# EAGLE schematic sputnik_prototype (EAGLE 7.4.0)
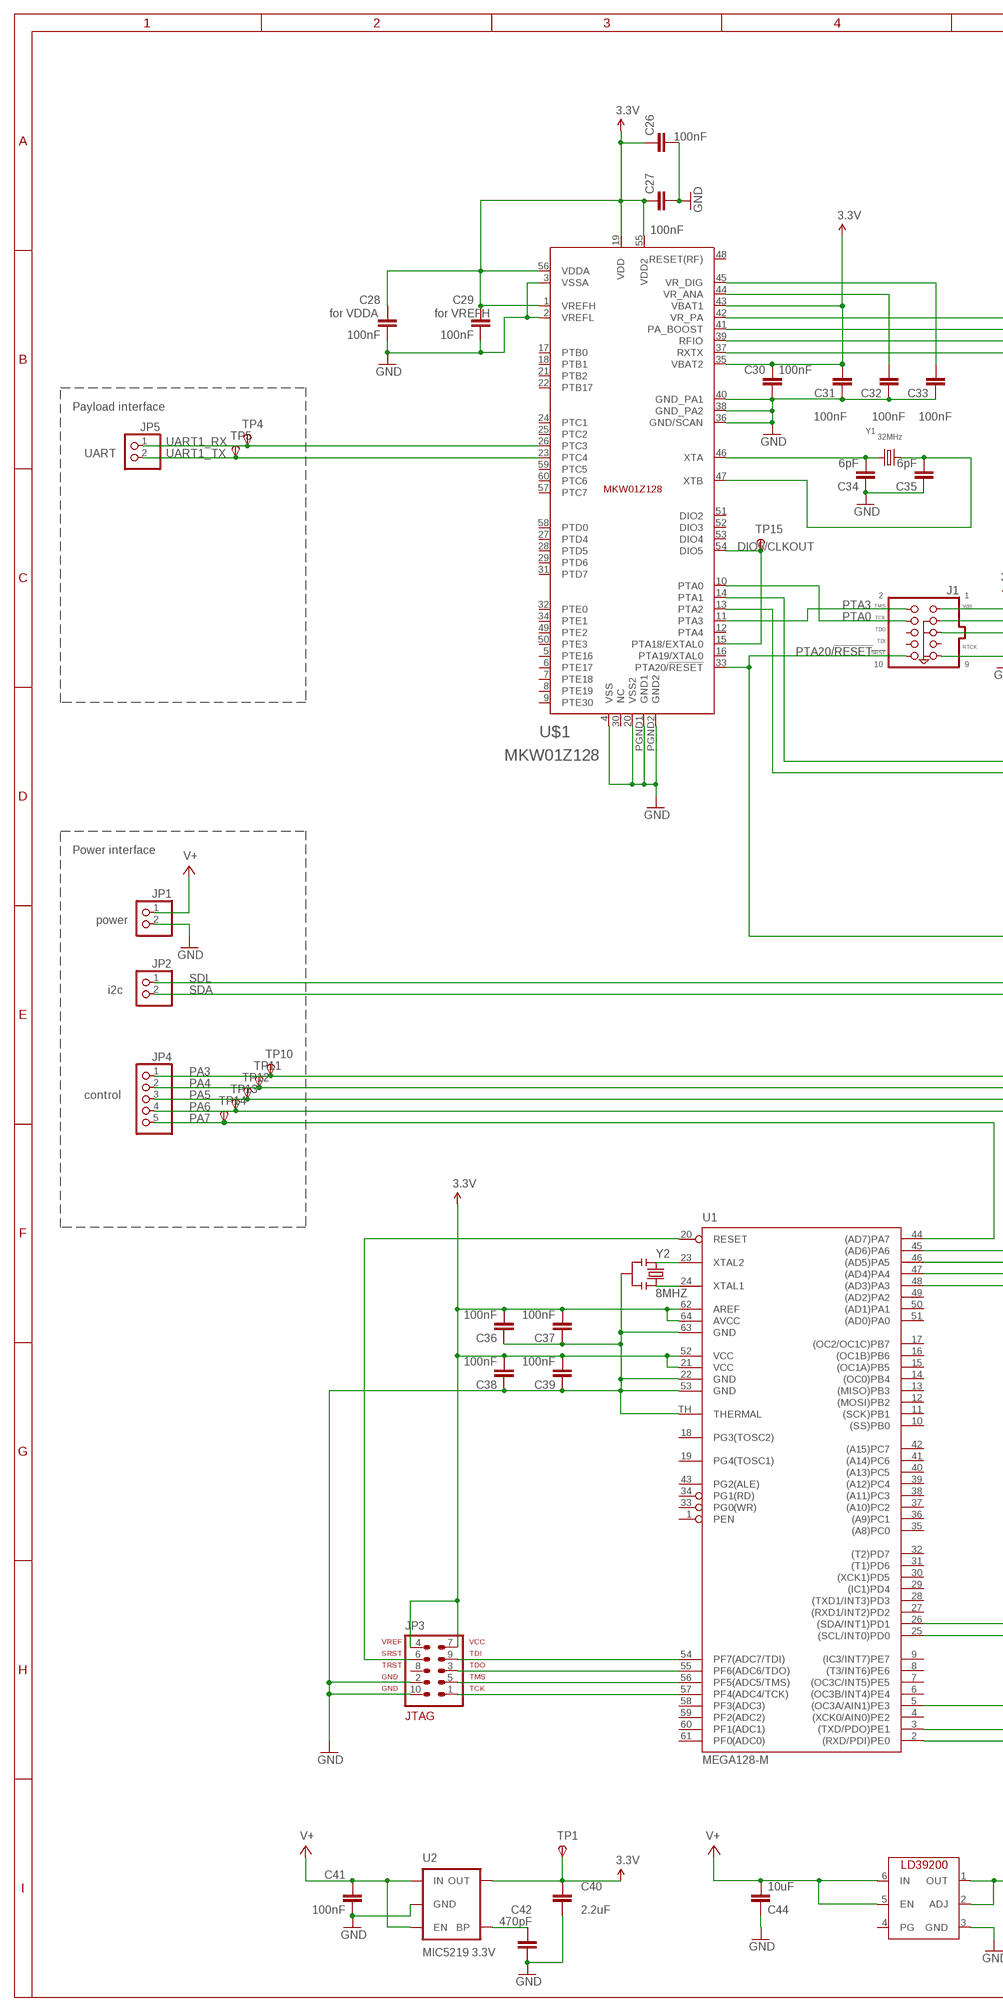
[diagram p0: schematic, sheet 1, part 1 of 2]
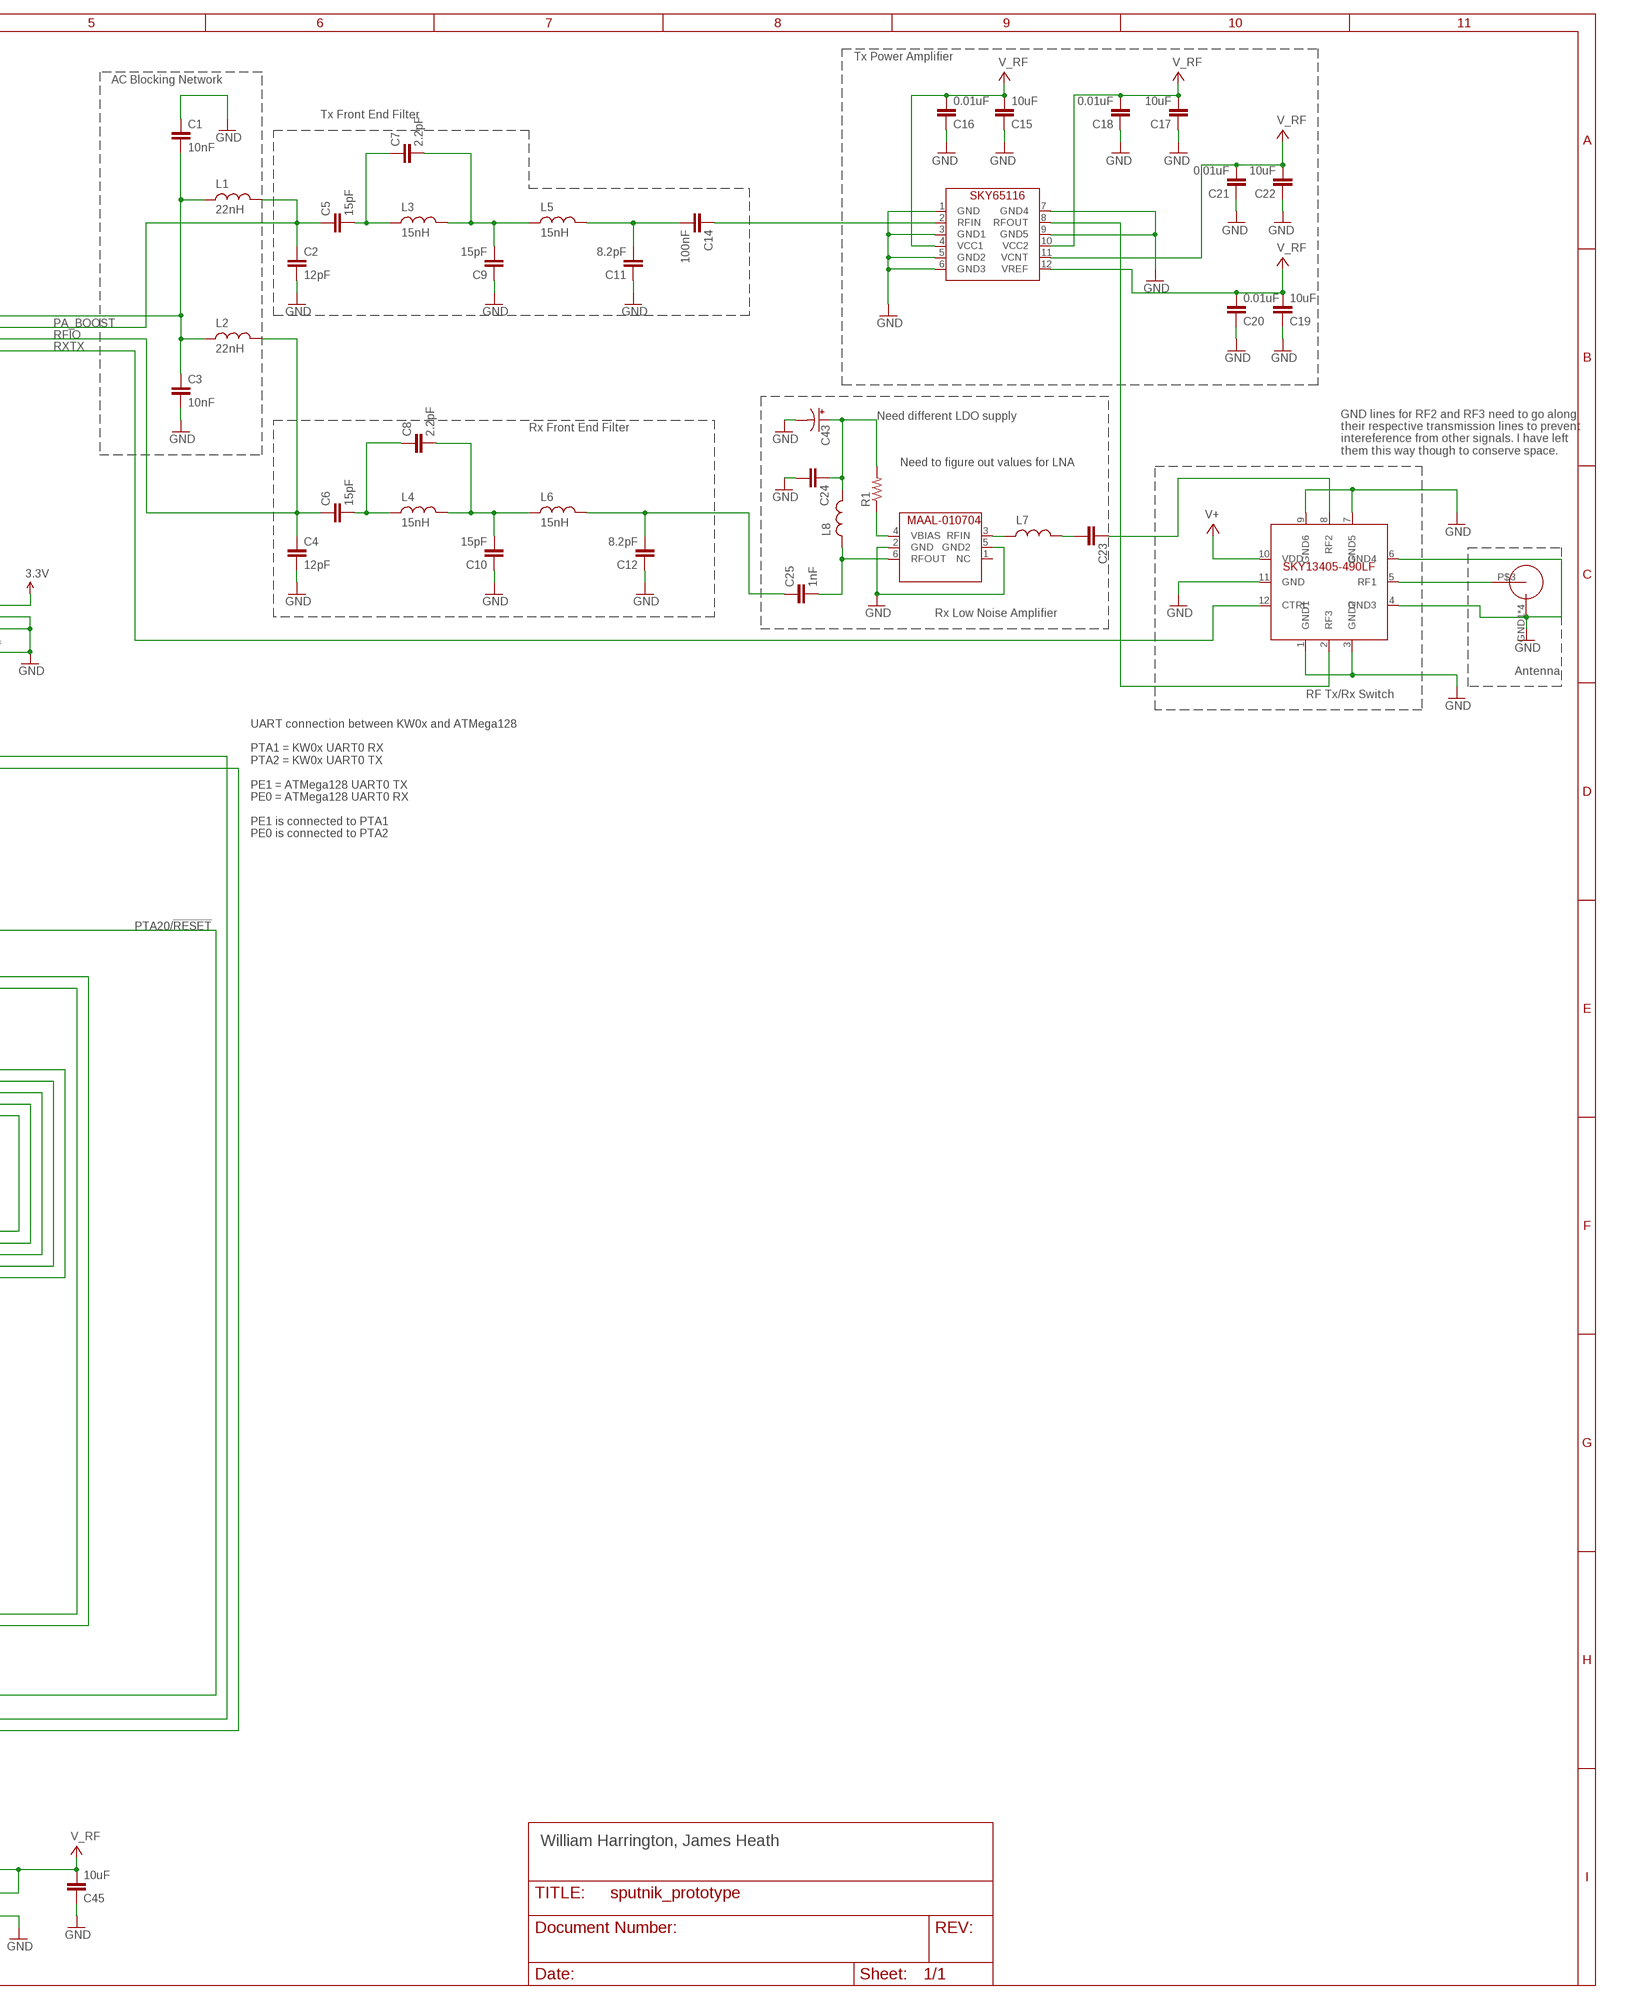
[diagram p1: schematic, sheet 1, part 2 of 2]

## Parts
C1  10nF  C-EU0603-B-NOSILK  [.0603-B-NOSILK]
C2  12pF  C-EU0603-B-NOSILK  [.0603-B-NOSILK]
C3  10nF  C-EU0603-B-NOSILK  [.0603-B-NOSILK]
C4  12pF  C-EU0603-B-NOSILK  [.0603-B-NOSILK]
C5  15pF  C-EU0603-B-NOSILK  [.0603-B-NOSILK]
C6  15pF  C-EU0603-B-NOSILK  [.0603-B-NOSILK]
C7  2.2pF  C-EU0603-B-NOSILK  [.0603-B-NOSILK]
C8  2.2pF  C-EU0603-B-NOSILK  [.0603-B-NOSILK]
C9  15pF  C-EU0603-B-NOSILK  [.0603-B-NOSILK]
C10  15pF  C-EU0603-B-NOSILK  [.0603-B-NOSILK]
C11  8.2pF  C-EU0603-B-NOSILK  [.0603-B-NOSILK]
C12  8.2pF  C-EU0603-B-NOSILK  [.0603-B-NOSILK]
C14  100nF  C-EU0603-B-NOSILK  [.0603-B-NOSILK]
C15  10uF  C-EU0603-B-NOSILK  [.0603-B-NOSILK]
C16  0.01uF  C-EU0603-B-NOSILK  [.0603-B-NOSILK]
C17  10uF  C-EU0603-B-NOSILK  [.0603-B-NOSILK]
C18  0.01uF  C-EU0603-B-NOSILK  [.0603-B-NOSILK]
C19  10uF  C-EU0603-B-NOSILK  [.0603-B-NOSILK]
C20  0.01uF  C-EU0603-B-NOSILK  [.0603-B-NOSILK]
C21  0.01uF  C-EU0603-B-NOSILK  [.0603-B-NOSILK]
C22  10uF  C-EU0603-B-NOSILK  [.0603-B-NOSILK]
C23  C-EU0402-B-NOSILK  [.0402-B-NOSILK]
C24  C-EU0402-B-NOSILK  [.0402-B-NOSILK]
C25  1nF  C-EU0402-B-NOSILK  [.0402-B-NOSILK]
C26  100nF  C-EU0603-B-NOSILK  [.0603-B-NOSILK]
C27  100nF  C-EU0603-B-NOSILK  [.0603-B-NOSILK]
C28  100nF  C-EU0603-B-NOSILK  [.0603-B-NOSILK]
C29  100nF  C-EU0603-B-NOSILK  [.0603-B-NOSILK]
C30  100nF  C-EU0603-B-NOSILK  [.0603-B-NOSILK]
C31  100nF  C-EU0603-B-NOSILK  [.0603-B-NOSILK]
C32  100nF  C-EU0603-B-NOSILK  [.0603-B-NOSILK]
C33  100nF  C-EU0603-B-NOSILK  [.0603-B-NOSILK]
C34  6pF  C-EU0603-B-NOSILK  [.0603-B-NOSILK]
C35  6pF  C-EU0603-B-NOSILK  [.0603-B-NOSILK]
C36  100nF  C-EU0603-B-NOSILK  [.0603-B-NOSILK]
C37  100nF  C-EU0603-B-NOSILK  [.0603-B-NOSILK]
C38  100nF  C-EU0603-B-NOSILK  [.0603-B-NOSILK]
C39  100nF  C-EU0603-B-NOSILK  [.0603-B-NOSILK]
C40  2.2uF  C-EU0603-B-NOSILK  [.0603-B-NOSILK]
C41  100nF  C-EU0603-B-NOSILK  [.0603-B-NOSILK]
C42  470pF  C-EU0603-B-NOSILK  [.0603-B-NOSILK]
C43  CPOL-USCT6032  [CT6032]
C44  10uF  C-EU0603-B-NOSILK  [.0603-B-NOSILK]
C45  10uF  C-EU0603-B-NOSILK  [.0603-B-NOSILK]
J1  JTAG_ARM-10-50MIL  [PINHEADER-2X5-0.05+POL+SILK]
JP1  PINHD-1X2  [1X02]
JP2  PINHD-1X2  [1X02]
JP3  AVR-JTAG-10  [AVR-JTAG-10]
JP4  PINHD-1X55X2MM  [1_05X2MM]
JP5  PINHD-1X2  [1X02]
L1  22nH  L-US0603-B-NOSILK  [.0603-B-NOSILK]
L2  22nH  L-US0603-B-NOSILK  [.0603-B-NOSILK]
L3  15nH  L-US0603-B-NOSILK  [.0603-B-NOSILK]
L4  15nH  L-US0603-B-NOSILK  [.0603-B-NOSILK]
L5  15nH  L-US0603-B-NOSILK  [.0603-B-NOSILK]
L6  15nH  L-US0603-B-NOSILK  [.0603-B-NOSILK]
L7  L-US0402-B-NOSILK  [.0402-B-NOSILK]
L8  L-US0603-B-NOSILK  [.0603-B-NOSILK]
R1  R-US_0603-B-NOSILK  [.0603-B-NOSILK]
TP1  TPSPAD1-13  [P1-13]
TP4  TPSPAD1-13  [P1-13]
TP5  TPSPAD1-13  [P1-13]
TP10  TPSPAD1-13  [P1-13]
TP11  TPSPAD1-13  [P1-13]
TP12  TPSPAD1-13  [P1-13]
TP13  TPSPAD1-13  [P1-13]
TP14  TPSPAD1-13  [P1-13]
TP15  TPSPAD1-13  [P1-13]
U1  MEGA128-M  [MLF64-TH]
U2  MIC5219 3.3V  SPARKFUN-POWERIC_V_REG_MIC52193.3V  [SPARKFUN-POWERIC_SOT23-5]
U$1  MKW01Z128  [MKW01Z128]
U$2  SMAJ716-ND  [SMAJ716-ND]
U$3  LD39200  [LD39200]
U$4  MAAL-010704  [MAAL-010704]
U$5  SKY13405-490LF  [SKY13405-490LF]
U$6  SKY65116  [SKY65116]
Y1  32MHz  CRYSTAL2.5X2.0MM  [CRYSTAL_2.5X2]
Y2  8MHZ  SPARKFUN-FREQCTRL_RESONATOR8MHZ  [SPARKFUN-FREQCTRL_RESONATOR-SMD]

## Nets
3.3V: C26.1 C27.1 C28.2 C29.2 C30.2 C31.2 C36.2 C37.2 C38.2 C39.2 C40.2 J1.1(VDD) JP3.4 JP3.7 TP1.TP(PP) U1.21(VCC) U1.52(VCC) U1.62(AREF) U1.64(AVCC) U2.5(OUT) U$1.1(VREFH) U$1.19(VDD) U$1.35(VBAT2) U$1.43(VBAT1) U$1.55(VDD2) U$1.56(VDDA)
DIO5/CLKOUT: TP15.TP(PP) U$1.15(PTA18/EXTAL0) U$1.54(DIO5)
GND: C1.1 C2.2 C3.2 C4.2 C9.1 C10.1 C11.1 C12.1 C15.1 C16.1 C17.1 C18.1 C19.1 C20.1 C21.1 C22.1 C24.2 C26.2 C27.2 C28.1 C29.1 C30.1 C31.1 C32.1 C33.1 C34.1 C35.1 C36.1 C37.1 C38.1 C39.1 C40.1 C41.1 C42.1 C43.- C44.1 C45.1 J1.3(GND3) J1.5(GND5) J1.9(GND9) JP1.2 JP3.2 JP3.10 U1.22(GND) U1.53(GND) U1.63(GND) U1.TH(THERMAL) U2.2(GND) U$1.2(VREFL) U$1.3(VSSA) U$1.4(VSS) U$1.20(VSS2) U$1.36(GND/SCAN) U$1.38(GND_PA2) U$1.40(GND_PA1) U$1.PGND1(GND1) U$1.PGND2(GND2) U$2.GND1(OUTERCONDUCTOR) U$2.GND2(OUTERCONDUCTOR) U$2.GND3(OUTERCONDUCTOR) U$2.GND4(OUTERCONDUCTOR) U$3.3(GND) U$4.2(GND) U$4.5(GND2) U$5.1(GND1) U$5.3(GND2) U$5.4(GND3) U$5.6(GND4) U$5.7(GND5) U$5.9(GND6) U$5.11(GND) U$6.1(GND) U$6.3(GND1) U$6.5(GND2) U$6.6(GND3) U$6.7(GND4) U$6.9(GND5) Y2.2
N$1: U1.3((TXD/PDO)PE1) U$1.14(PTA1)
N$2: U1.2((RXD/PDI)PE0) U$1.13(PTA2)
N$3: C42.2 U2.4(BP)
N$5: C23.1 U$5.8(RF2)
N$6: C34.2 U$1.46(XTA) Y1.1
N$7: C25.2 L8.1 U$4.6(RFOUT)
N$8: C35.2 U$1.47(XTB) Y1.3
N$10: C5.2 C7.1 L3.1
N$11: JP3.1 U1.57(PF4(ADC4/TCK))
N$12: JP3.3 U1.55(PF6(ADC6/TDO))
N$13: JP3.5 U1.56(PF5(ADC5/TMS))
N$14: JP3.9 U1.54(PF7(ADC7/TDI))
N$15: JP3.6 U1.20(RESET)
N$16: C7.2 C9.2 L3.2 L5.1
N$17: C11.2 C14.2 L5.2
N$18: C6.2 C8.1 L4.1
N$19: C8.2 C10.2 L4.2 L6.1
N$20: C12.2 C25.1 L6.2
N$21: C14.1 U$6.2(RFIN)
N$22: U$5.2(RF3) U$6.8(RFOUT)
N$23: U1.23(XTAL2) Y2.1
N$24: L7.1 U$4.3(RFIN)
N$25: C23.2 L7.2
N$26: C24.1 C43.+ L8.2 R1.2
N$27: R1.1 U$4.4(VBIAS)
N$29: C1.2 C3.1 L1.1 L2.1 U$1.42(VR_PA)
N$30: U$2.P$3(CENTERCONDUCTOR) U$5.5(RF1)
N$31: C32.2 U$1.44(VR_ANA)
N$34: C33.2 U$1.45(VR_DIG)
N$36: U1.24(XTAL1) Y2.3
PA3: JP4.1 TP10.TP(PP) U1.48((AD3)PA3)
PA4: JP4.2 TP11.TP(PP) U1.47((AD4)PA4)
PA5: JP4.3 TP12.TP(PP) U1.46((AD5)PA5)
PA6: JP4.4 TP13.TP(PP) U1.45((AD6)PA6)
PA7: JP4.5 TP14.TP(PP) U1.44((AD7)PA7)
PA_BOOST: C2.1 C5.1 L1.2 U$1.41(PA_BOOST)
PTA0: J1.4(TCK) U$1.10(PTA0)
PTA3: J1.2(TMS) U$1.11(PTA3)
PTA20/!RESET: J1.10(SRST) U1.5((OC3A/AIN1)PE3) U$1.33(PTA20/!RESET)
RFIO: C4.1 C6.1 L2.2 U$1.39(RFIO)
RXTX: U$1.37(RXTX) U$5.12(CTRL)
SDA: JP2.2 U1.26((SDA/INT1)PD1)
SDL: JP2.1 U1.25((SCL/INT0)PD0)
UART1_RX: JP5.1 TP4.TP(PP) U$1.26(PTC3)
UART1_TX: JP5.2 TP5.TP(PP) U$1.23(PTC4)
V+: C15.2 C16.2 C17.2 C18.2 C19.2 C20.2 C21.2 C22.2 C41.2 C44.2 C45.2 JP1.1 U2.1(IN) U2.3(EN) U$3.1(OUT) U$3.2(ADJ) U$3.5(EN) U$3.6(IN) U$5.10(VDD) U$6.4(VCC1) U$6.10(VCC2) U$6.11(VCNT) U$6.12(VREF) ; supply symbol labelled V_RF
Unconnected: J1.6(TDO) J1.7(RTCK) J1.8(TDI) JP3.8 U1.1(PEN) U1.4((XCK0/AIN0)PE2) U1.6((OC3B/INT4)PE4) U1.7((OC3C/INT5)PE5) U1.8((T3/INT6)PE6) U1.9((IC3/INT7)PE7) U1.10((SS)PB0) U1.11((SCK)PB1) U1.12((MOSI)PB2) U1.13((MISO)PB3) U1.14((OC0)PB4) U1.15((OC1A)PB5) U1.16((OC1B)PB6) U1.17((OC2/OC1C)PB7) U1.18(PG3(TOSC2)) U1.19(PG4(TOSC1)) U1.27((RXD1/INT2)PD2) U1.28((TXD1/INT3)PD3) U1.29((IC1)PD4) U1.30((XCK1)PD5) U1.31((T1)PD6) U1.32((T2)PD7) U1.33(PG0(WR)) U1.34(PG1(RD)) U1.35((A8)PC0) U1.36((A9)PC1) U1.37((A10)PC2) U1.38((A11)PC3) U1.39((A12)PC4) U1.40((A13)PC5) U1.41((A14)PC6) U1.42((A15)PC7) U1.43(PG2(ALE)) U1.49((AD2)PA2) U1.50((AD1)PA1) U1.51((AD0)PA0) U1.58(PF3(ADC3)) U1.59(PF2(ADC2)) U1.60(PF1(ADC1)) U1.61(PF0(ADC0)) U$1.5(PTE16) U$1.6(PTE17) U$1.7(PTE18) U$1.8(PTE19) U$1.9(PTE30) U$1.12(PTA4) U$1.16(PTA19/XTAL0) U$1.17(PTB0) U$1.18(PTB1) U$1.21(PTB2) U$1.22(PTB17) U$1.24(PTC1) U$1.25(PTC2) U$1.27(PTD4) U$1.28(PTD5) U$1.29(PTD6) U$1.30(NC) U$1.31(PTD7) U$1.32(PTE0) U$1.34(PTE1) U$1.48(RESET(RF)) U$1.49(PTE2) U$1.50(PTE3) U$1.51(DIO2) U$1.52(DIO3) U$1.53(DIO4) U$1.57(PTC7) U$1.58(PTD0) U$1.59(PTC5) U$1.60(PTC6) U$3.4(PG) U$4.1(NC)

## Notes on the sheet
- Tx Power Amplifier
- AC Blocking Network
- Tx Front End Filter
- for VDDA | for VREFH
- Payload interface
- Need different LDO supply
- Rx Front End Filter
- UART
- GND lines for RF2 and RF3 need to go along
  their respective transmission lines to prevent
  intereference from other signals. I have left
  them this way though to conserve space.
- Need to figure out values for LNA
- Rx Low Noise Amplifier
- Antenna
- RF Tx/Rx Switch
- UART connection between KW0x and ATMega128
  
  PTA1 = KW0x UART0 RX
  PTA2 = KW0x UART0 TX
  
  PE1 = ATMega128 UART0 TX
  PE0 = ATMega128 UART0 RX
  
  PE1 is connected to PTA1
  PE0 is connected to PTA2
- Power interface
- power
- i2c
- control
- William Harrington, James Heath

## Library data of the parts
C1-C12 C14-C42 C44 C45 = rcl_custom:C-EU: CAPACITOR, European symbol
C43 = rcl:CPOL-US: POLARIZED CAPACITOR, American symbol
J1 = psas_c3_team05:JTAG_ARM-10-*: JTAG PIN HEADER 2x5 This is one of the (smaller) ARM standard JTAG connectors.
JP1 JP2 JP5 = psas_c3_team05:PINHD-1X2: PIN HEADER
JP3 = Vibrogait_prototype:AVR-JTAG-10: AVR JTAG Debug/Programming Header
JP4 = pinhead:PINHD-1X5: PIN HEADER
L1-L8 = rcl_custom:L-US: INDUCTOR, American symbol
R1 = rcl_custom:R-US_: RESISTOR, American symbol
TP1 TP4 TP5 TP10-TP15 = testpad:TPS: TEST PIN
U1 = atmel:MEGA128-M: MICROCONTROLLER 128 Kbytes FLASH 4 Kbytes SRAM 4 Kbytes EEPROM DUAL USART 8-channel 10 bit ADC Source: avr.lbr; MPN: ATMEGA128-16MU; OC_FARNELL: 1455093; OC_NEWARK: 58M3717
U2 = Lilypad_Arduino_USB_v12:SPARKFUN-POWERIC_V_REG_MIC5219: V_REG MIC5219 Standard 3.3V and 5V 500mA LDO voltage regulator in SOT-23 layout. Micrel part MIC5219. BP (by-pass) pin is used to lower output noise with 470pF cap, may be left open.; PROD_ID: VREG-09872
U$1 = psas_c3_team05:MKW01Z128
U$2 = psas_c3_team05:SMAJ716-ND
U$3 = psas_c3_team05:LD39200
U$4 = sputnik:MAAL-010704: MACOM MAAL-010704 Low Noise Amplifier
U$5 = psas_c3_team05:SKY13405-490LF
U$6 = psas_c3_team05:SKY65116: SKYWORK SKY65116 LINEAR POWER AMPLIFIER
Y1 = microbuilder:CRYSTAL: Crystals HC49UP - Surface Mount Crystal 4.0MHz 18pF +/-30ppm Surface Mount Crystal [Digikey: 535-9857-1-ND] 12.0 MHz Surface Mount Crystal [Digikey: 535-9869-6-ND] 25.0 MHz Surface Mount Crystal [Digikey: 535-9078-1-ND] 2.5 x 2.0mm - MEMs SMT Crystal 16.0 MHz 10pF 20ppm 2.5 x 2.0mm Crystal [Digikey -40-85°C: 535-10923-1-ND] 3.2 x 2.5mm - MEMs SMT Crystal 12.0 MHz 8pF 15ppm 3.2 x 2.5mm Crystal [Digikey: -10-70°C: 644-1047-1-ND -40-125°C: 644-1128-1-ND] 16.0 MHz 8pF 15ppm 3.2 x 2.5mm Crystal [Digikey: -10-70°C: 644-1049-1-ND -40-125°C: 644-1129-2-ND] 16.0 MHz 10pF 10ppm 3.2 x 2.5mm Crystal [Digikey: 644-1100-1-ND] 27.12 MHz 18pF 30ppm 3.2 x 2.5mm Crystal [Digikey: 887-1424-1-ND] 27.12MHz 10pF 10ppm 3.2 x 2.5mm Crystal [Digikey: 887-1329-1-ND] 4.9 x 1.8mm - MEMs SMT Crystal 32.768 KHz 12.5pF 20ppm 4.9 x 1.8mm Crystal [Digikey: SE2415CT-ND] 8.0 x 3.8mm - Surface Mount Crystal 32.768kHz 12.5pF 20ppm -40°C-85°C [Digikey: 535-9166-2-ND] Cylinder 32.768KHz Cylinder Crystal (2x6mm body) [Ex. Digikey: 300-8341-2-ND]; DIST: Digi-Key; DPN: SER4044CT-ND; MFG: EPSON; MPN: FA20H 32.0000MF12Y-W3
Y2 = Lilypad_Arduino_USB_v12:SPARKFUN-FREQCTRL_RESONATOR: Resonator Small SMD resonator. Used, eg, on the Arduino Pro/ Pro Mini boards. 8MHz- XTAL-08895 16MHz- XTAL-08900; PROD_ID: XTAL-08895